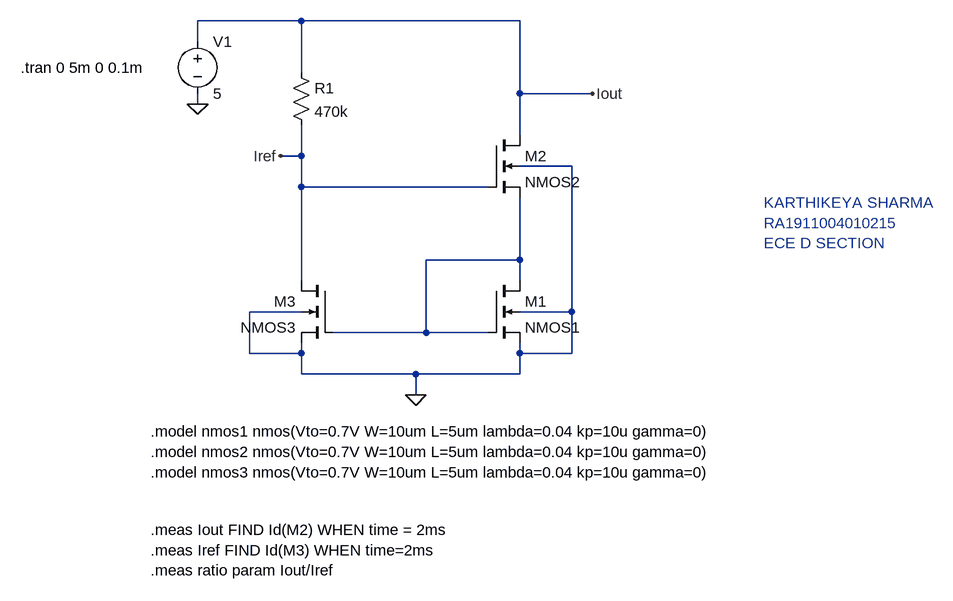
[diagram p0: schematic wilson_current_mirror.asc]
wilson_current_mirror.asc, the LTspice schematic file:
Version 4
SHEET 1 1264 680
WIRE 288 -848 128 -848
WIRE 624 -848 288 -848
WIRE 128 -816 128 -848
WIRE 288 -768 288 -848
WIRE 624 -736 624 -848
WIRE 736 -736 624 -736
WIRE 128 -720 128 -736
WIRE 624 -672 624 -736
WIRE 288 -640 288 -688
WIRE 288 -640 256 -640
WIRE 704 -624 624 -624
WIRE 288 -592 288 -640
WIRE 576 -592 288 -592
WIRE 624 -480 624 -576
WIRE 624 -480 480 -480
WIRE 288 -448 288 -592
WIRE 624 -448 624 -480
WIRE 288 -400 208 -400
WIRE 704 -400 704 -624
WIRE 704 -400 624 -400
WIRE 480 -368 480 -480
WIRE 480 -368 336 -368
WIRE 576 -368 480 -368
WIRE 208 -336 208 -400
WIRE 288 -336 288 -352
WIRE 288 -336 208 -336
WIRE 624 -336 624 -352
WIRE 704 -336 704 -400
WIRE 704 -336 624 -336
WIRE 288 -304 288 -336
WIRE 464 -304 288 -304
WIRE 624 -304 624 -336
WIRE 624 -304 464 -304
WIRE 464 -272 464 -304
FLAG 464 -272 0
FLAG 128 -720 0
FLAG 736 -736 Iout
FLAG 256 -640 Iref
SYMBOL nmos4 576 -672 R0
SYMATTR InstName M2
SYMATTR Value NMOS2
SYMBOL nmos4 576 -448 R0
SYMATTR InstName M1
SYMATTR Value NMOS1
SYMBOL nmos4 336 -448 M0
SYMATTR InstName M3
SYMATTR Value NMOS3
SYMBOL voltage 128 -832 R0
WINDOW 123 0 0 Left 0
WINDOW 39 0 0 Left 0
SYMATTR InstName V1
SYMATTR Value 5
SYMBOL res 272 -784 R0
SYMATTR InstName R1
SYMATTR Value 470k
TEXT 56 -216 Left 2 !.model nmos1 nmos(Vto=0.7V W=10um L=5um lambda=0.04 kp=10u gamma=0)
TEXT 56 -184 Left 2 !.model nmos2 nmos(Vto=0.7V W=10um L=5um lambda=0.04 kp=10u gamma=0)\n.model nmos3 nmos(Vto=0.7V W=10um L=5um lambda=0.04 kp=10u gamma=0)
TEXT 56 -64 Left 2 !.meas Iout FIND Id(M2) WHEN time = 2ms\n.meas Iref FIND Id(M3) WHEN time=2ms\n.meas ratio param Iout/Iref
TEXT -144 -776 Left 2 !.tran 0 5m 0 0.1m
TEXT 1000 -568 Left 2 ;KARTHIKEYA SHARMA\nRA1911004010215\nECE D SECTION

The netlist it stands for:
* wilson_current_mirror.asc
M2 Iout Iref N001 0 NMOS2
M1 N001 N001 0 0 NMOS1
M3 Iref N001 0 0 NMOS3
V1 Iout 0 5
R1 Iout Iref 470k
.model NMOS NMOS
.model PMOS PMOS
.lib standard.mos
.model nmos1 nmos(Vto=0.7V W=10um L=5um lambda=0.04 kp=10u gamma=0)
.model nmos2 nmos(Vto=0.7V W=10um L=5um lambda=0.04 kp=10u gamma=0)
.model nmos3 nmos(Vto=0.7V W=10um L=5um lambda=0.04 kp=10u gamma=0)
.meas Iout FIND Id(M2) WHEN time = 2ms
.meas Iref FIND Id(M3) WHEN time=2ms
.meas ratio param Iout/Iref
.tran 0 5m 0 0.1m
* KARTHIKEYA SHARMA
* RA1911004010215
* ECE D SECTION
.backanno
.end